# Altium project ALTIUM_{TEX139}_HV-1PH-DCAC-R3.PrjPcb (part 2 of 2)

## Sheet JTAG-USB-POWER.SchDoc
size A4; PageSetup: Record=PageOptions|CenterHorizontal=True|CenterVertical=True|PrintScale=1.06|XCorrection=1.00|YCorrection=1.00|PrintKind=1|BorderSize=5000000|LeftOffset=0|BottomOffset=0|Orientation=2|PaperLength=1000|PaperWidth=1000|Scale=100|PaperSource=15|PrintQuality=600|MediaType=1|DitherType=10|PaperKind=Legal|PrintScaleMode=1
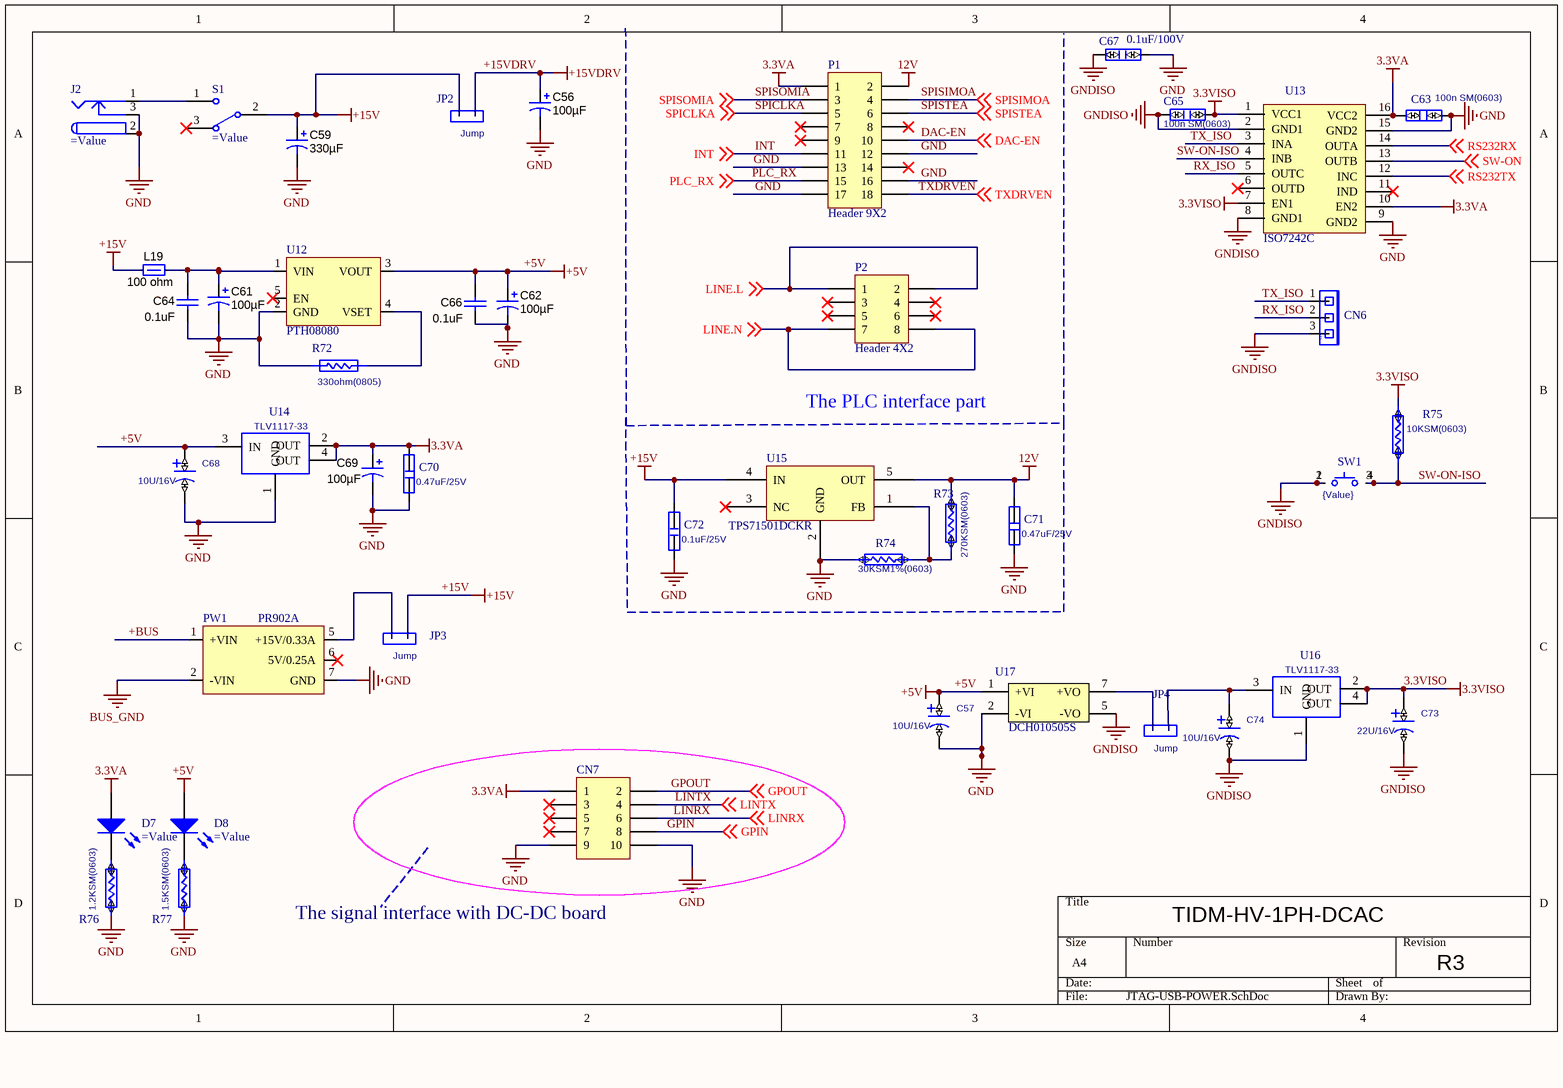
[diagram p2: JTAG-USB-POWER.SchDoc]

### Parts
C56  ValueDisplayed: 100µF  [CAPSMT_62_HA0]  (hidden comment: EMVA500ADA101MHA0G)
C57  10U/16V  [CAP-3528]
C59  ValueDisplayed: 330µF  [CAPSMT_62_HA0]  (hidden comment: 2R5SVPE330M)
C61  ValueDisplayed: 100µF  [CAPSMT_62_HA0]  (hidden comment: EMVA500ADA101MHA0G)
C62  ValueDisplayed: 100µF  [CAPSMT_62_HA0]  (hidden comment: EMVA500ADA101MHA0G)
C63  100n SM(0603)  [C0603SM]
C64  value 0.1uF  [0805]  (hidden comment: Used in BOM report)
C65  100n SM(0603)  [C0603SM]
C66  value 0.1uF  [0805]  (hidden comment: Used in BOM report)
C67  0.1uF/100V  [C/7.5/3/7.5/R3]
C68  10U/16V  [CAP-3528]
C69  ValueDisplayed: 100µF  [CAPSMT_62_HA0]  (hidden comment: EMVA500ADA101MHA0G)
C70  0.47uF/25V  [C0603SM]
C71  0.47uF/25V  [C0603SM]
C72  0.1uF/25V  [C0603SM]
C73  22U/16V  [CAP-3528]
C74  10U/16V  [CAP-3528]
CN6  SCI_PORT  [HDR1X3]  (value not drawn)
CN7  (no value)  [HDR2X5]
D7  (no value)  [LED0805]
D8  (no value)  [LED0805]
J2  (no value)  [DCJACK]
JP2  Jump  [HDR1X2]
JP3  Jump  [HDR1X2]
JP4  Jump  [HDR1X2]
L19  value 100 ohm  [1206]  (hidden comment: HI1206N101R-10)
P1  Header 9X2  [HDR2X9]
P2  Header 4X2  [HDR2X4]
PW1  (no value)  [PR902A]
R72  330ohm(0805)  [R0805BSM]
R73  270KSM(0603)  [R0603SM]
R74  30KSM1%(0603)  [R0603SM]
R75  10KSM(0603)  [R0603SM]
R76  1.2KSM(0603)  [R0603SM]
R77  1.5KSM(0603)  [R0603SM]
S1  (no value)  [SW-3P8X5]
SW1  {Value}  [KRS640]
U12  (no value)  [PTH08080]
U13  (no value)  [IC-SOIC16P-1.27DW]
U14  TLV1117-33  [SOT-223-3P]
U15  TPS71501DCKR  [SOT5-DCK(SC-70)]
U16  TLV1117-33  [SOT-223-3P]
U17  (no value)  [DCH010505]

### Nets
3.3VA: C63.2 C69.1(+) C70.2 CN7.1 D7.1(A) P1.1 U13.10(EN2) U13.16(VCC2) U14.2(OUT) U14.4(OUT)
3.3VISO: C65.1 C73.1 R75.1 U13.1(VCC1) U13.7(EN1) U16.2(OUT) U16.4(OUT)
12V: C71.2 P1.2 R73.1 U15.5(OUT)
+5V: C57.1 C62.1(+) C66.1 C68.1 D8.1(A) U12.3(VOUT) U14.3(IN) U17.1(+VI)
+15V: C59.1(+) C72.2 JP2.1 JP3.2 L19.1 S1.2 U15.4(IN)
+15VDRV: C56.1(+) JP2.2
BUS_GND: PW1.2(-VIN)  [project net Q2PWM-]
GND: C56.2(-) C57.2 C59.2(-) C61.2(-) C62.2(-) C63.1 C64.2 C66.2 C67.1 C68.2 C69.2(-) C70.1 C71.1 C72.1 CN7.9 CN7.10 J2.2 J2.3 P1.12 P1.13 P1.16 P1.17 PW1.7(GND) R72.1 R74.1 R76.2 R77.2 U12.2(GND) U13.9(GND2) U13.15(GND2) U14.1(GND) U15.2(GND) U17.2(-VI)
GNDISO: C65.2 C67.2 C73.2 C74.2 CN6.3 SW1.1 SW1.2 U13.2(GND1) U13.8(GND1) U16.1(GND) U17.5(-VO)
+BUS: PW1.1(+VIN)
DAC-EN: P1.10 ; off-sheet DAC-EN
GPIN: CN7.8 ; off-sheet GPIN
GPOUT: CN7.2 ; off-sheet GPOUT
INT: P1.11 ; off-sheet INT
LINE.L: P2.1 P2.2 ; off-sheet LINE.L
LINE.N: P2.7 P2.8 ; off-sheet LINE.N
LINRX: CN7.6 ; off-sheet LINRX
LINTX: CN7.4 ; off-sheet LINTX
PLC_RX: P1.15 ; off-sheet PLC_RX
RS232RX: U13.14(OUTA) ; off-sheet RS232RX
RS232TX: U13.12(INC) ; off-sheet RS232TX
RX_ISO: CN6.2 U13.5(OUTC)
SPICLKA: P1.5 ; off-sheet SPICLKA
SPISIMOA: P1.4 ; off-sheet SPISIMOA
SPISOMIA: P1.3 ; off-sheet SPISOMIA
SPISTEA: P1.6 ; off-sheet SPISTEA
SW-ON: U13.13(OUTB) ; off-sheet SW-ON
SW-ON-ISO: R75.2 SW1.3 SW1.4 U13.4(INB)
TX_ISO: CN6.1 U13.3(INA)
TXDRVEN: P1.18 ; off-sheet TXDRVEN
NetC61_1: C61.1(+) C64.1 L19.2 U12.1(VIN)
NetC74_1: C74.1 JP4.2 U16.3(IN)
NetD7_2: D7.2(K) R76.1
NetD8_2: D8.2(K) R77.1
NetJ2_1: J2.1 S1.1
NetJP3_1: JP3.1 PW1.5(+15V/0.33A)
NetJP4_1: JP4.1 U17.7(+VO)
NetR72_2: R72.2 U12.4(VSET)
NetR73_2: R73.2 R74.2 U15.1(FB)

Not connected (* = marked no-connect by the designer): CN7 3* 5* 7*; P1 7* 8* 9* 14*; P2 3* 4* 5* 6*; PW1 6(5V/0.25A)*; S1 3*; U12 5(EN)*; U13 6(OUTD)* 11(IND)*; U15 3(NC)*

### Notes on the sheet
- The PLC interface part
- The signal interface with DC-DC board
- TIDM-HV-1PH-DCAC
- R3
- (in symbol Component_1) PTH08080
- (in symbol DB01P03) F
- (in symbol ISO7242) ISO7242C

### Library data of the parts
C56 C61 C62 C69 = EMVA500ADA101MHA0G: CAP, AL, 100uF, 50V, +/-20%,  ohm, SMD; Manufacturer: Nippon Chemi-Con; Polarized: Y; CompType: Capacitor; U/M: EA; Cap_F: 0.0001; Tolerance_%: 20; Value1: Unknown; VDC_V: 50; IRMS_A: 0.19; TaMin_C: -40; TaMax_C: 85; Cap_Case: HA0; SymbolVersion: 2008-07-09; Value: 100uF; PartNumber: EMVA500ADA101MHA0G; PackageReference: HA0; RoHS: Y; Value2: 50V; MountType: SMT; Technology: AL; Series: MVA; Publisher: Texas Instruments; LatestRevisionDate: 2014-05-13; ComponentLink1Description: Datasheet link; ComponentLink1URL: http://www.chemi-con.co.jp/e/catalog/pdf/al-e/al-sepa-e/003-chip/al-mva-e-111201.pdf; Supplier 1: Digi-Key; Supplier Part Number 1: 565-2133-1-ND; Supplier 2: Mouser; Supplier Part Number 2: 661-EMVA500ADA101MHA; Supplier 3: Farnell; Supplier Part Number 3: 1698733
C57 C68 C73 C74 = CE5080R
  C57 C68 C74: Value: 10U/16V
  C73: Value: 22U/16V
C59 = 2R5SVPE330M: CAP, AL, 330uF, 2.5V, +/-20%, 0.015 ohm, SMD; Manufacturer: Sanyo; Polarized: Y; CompType: Capacitor; U/M: EA; Cap_F: 0.00033; Tolerance_%: 20; VDC_V: 2.5; ESR_Ohm: 0.015; IRMS_A: 3.15; TaMin_C: -55; TaMax_C: 105; SymbolVersion: 2008-07-09; Value: 330uF; PartNumber: 2R5SVPE330M; PackageReference: E61; RoHS: Y; Value1: 0.015 ohm; Value2: 2.5V; MountType: SMT; Technology: AL; Series: SVPE; Publisher: Texas Instruments; LatestRevisionDate: 2014-06-17; ComponentLink1Description: Datasheet link; ComponentLink1URL: http://industrial.panasonic.com/www-data/pdf/AAB8000/AAB8000CE2.pdf
C63 C65 = C0603SM: Value: 100n SM(0603)
C64 C66 = Capacitor: CAP, CERM, xxxF, xxV, [TempCo], xx%, [PackageReference]; Polarized: N; U/M: EA; CompType: Capacitor; SymbolVersion: 2008-07-09; PackageReference: Used in PnP output; Manufacturer: Used in BOM report; PartNumber: Used in BOM report; RoHS: Used in BOM report.  Use Y or N.; MountType: SMT or TH (used in PnP report); ComponentLink1Description: Datasheet Link; ComponentLink1URL: Paste URL for datasheet here; Publisher: Texas Instruments; LatestRevisionDate: 2014-06-06; LatestRevisionNote: Added Alternate PartNumber and Alternate Manufacturer parameters to appropriate components.; Alternate Manufacturer: -; Alternate PartNumber: -
C67 = C0603SM: Value: 100n
C70-C72 = C0805BSM
  C70 C71: Value: 0.47uF/25V
  C72: Value: 0.1uF/25V
CN6 = DB01P03: Value: SCI_PORT
CN7 = Header 5X2: Header, 5-Pin, Dual row; LatestRevisionDate: 17-Jul-2002; LatestRevisionNote: Re-released for DXP Platform.; Publisher: Altium Limited
D7 D8 = LED0: Typical INFRARED GaAs LED; Published: 8-Jun-2000; LatestRevisionDate: 08-Jul-2005; LatestRevisionNote: Mech Layer 1 removed.; PackageReference: LED-0; Publisher: Altium Limited
J2 = PWR2.5: Low Voltage Power Supply Connector; Published: 17-Dec-2003; DatasheetDocument: 09-May-2002; Publisher: Altium Limited; ComponentLink1Description: Manufacturer Link; ComponentLink1URL: http://domino.kycon.com/internet/Products.html
JP2-JP4 = J7: Value: Jump
L19 = HI1206N101R-10: Ferrite Bead, 100 ohm @ 100MHz, 3A, 1206; Manufacturer: Laird-Signal Integrity Products; Imax_A: 3; DCR_ohm: 0.035; Value1: 0.035 ohm; ZTyp@100MHz_Ohm: 100; Ztyp@1GHz_Ohm: 145; CompType: Ferrite Bead; SymbolVersion: 2009-06-02; PartNumber: HI1206N101R-10; Value2: 3A; MountType: SMT; PackageReference: 1206; Published: 2014-04-30; Publisher: Texas Instruments; LatestRevisionDate: 2014-04-30; ComponentLink1Description: Datasheet link; ComponentLink1URL: http://www.lairdtech.com/DownloadAsset.aspx?id=4847; RoHS: Y; Supplier 1: Digi-Key; Supplier Part Number 1: 240-2408-1-ND; Supplier 2: Mouser; Supplier Part Number 2: 875-HI1206N101R-10; Supplier 3: Farnell; Supplier Part Number 3: 1697228
P1 = Header 9X2: Header, 9-Pin, Dual row; LatestRevisionDate: 17-Jul-2002; LatestRevisionNote: Re-released for DXP Platform.; Publisher: Altium Limited
P2 = Header 4X2: Header, 4-Pin, Dual row; LatestRevisionDate: 17-Jul-2002; LatestRevisionNote: Re-released for DXP Platform.; Publisher: Altium Limited
PW1 = PR902A
R72 = R0805BSM: Value: 330ohm(0805)
R73-R77 = R0603SM
  R73: Value: 270KSM(0603)
  R74: Value: 30KSM1%(0603)
  R75: Value: 10KSM(0603)
  R76: Value: 1.2KSM(0603)
  R77: Value: 1.5KSM(0603)
S1 = SW-SPDT: SPDT Subminiature Toggle Switch, Right Angle Mounting, Vertical Actuation; Published: 24-Mar-1999; LatestRevisionDate: 17-Dec-2003; LatestRevisionNote: Schematic revised, PCB Footprint replaced.; DatasheetDocument: 05-Dec-2000; PackageReference: TL36WW15050; Publisher: Altium Limited; ComponentLink1Description: Manufacturer Link; ComponentLink1URL: http://www.apem.com
SW1 = KRS640: PDIF_TY: 12600; Value: {Value}
U12 = Component_1
U13 = ISO7242
U14 U16 = LM1117SM: Value: TLV1117-33
U17 = DCH010505S

## Nets that join several sheets
3.3VA: CNTL (L18.1 R69.2), Main (6 pins), JTAG-USB-POWER (10 pins)
+5V: CNTL (6 pins), Main (7 pins), JTAG-USB-POWER (8 pins)
+15V: Main (8 pins), JTAG-USB-POWER (7 pins)
+15VDRV: Main (CN1.1 CN2.1 CN3.1 CN4.1), JTAG-USB-POWER (C56.1 JP2.2)
GND: CNTL (30 pins), Main (36 pins), JTAG-USB-POWER (33 pins)
Q2PWM-: CNTL (R78.1), Main (29 pins), JTAG-USB-POWER (PW1.2)
+BUS: Main (14 pins), JTAG-USB-POWER (PW1.1)
BUS.V+: CNTL (R79.2), Main (C9.1 R15.1 R16.2)
DAC-EN: CNTL (H5.70), JTAG-USB-POWER (P1.10)
FAULT: CNTL (R70.1), Main (CN1.7 CN2.7 CN3.7 CN4.7)
GPIN: CNTL (H5.57), JTAG-USB-POWER (CN7.8)
GPOUT: CNTL (H5.61), JTAG-USB-POWER (CN7.2)
I.inv1+: CNTL (R67.1), Main (U1.9)
INT: CNTL (H5.68), JTAG-USB-POWER (P1.11)
LINE.L: Main (F1.3 F1.4 J1.1 TP1.1), JTAG-USB-POWER (P2.1 P2.2)
LINE.N: Main (F3.3 F3.4 J1.2 TP2.1), JTAG-USB-POWER (P2.7 P2.8)
LINE.V+: CNTL (R60.1), Main (R2.2)
LINRX: CNTL (H5.63), JTAG-USB-POWER (CN7.6)
LINTX: CNTL (H5.59), JTAG-USB-POWER (CN7.4)
N.V+: CNTL (R56.1), Main (R27.2)
OPRLY: CNTL (H5.52), Main (R30.1)
PLC_RX: CNTL (H5.12 H5.27), JTAG-USB-POWER (P1.15)
Q1.PWM: CNTL (TP15.1 U9.16), Main (CN1.4)
Q2.PWM: CNTL (TP16.1 U9.15), Main (CN2.4)
Q3.PWM: CNTL (TP17.1 U9.14), Main (CN3.4)
Q4.PWM: CNTL (TP20.1 U9.13), Main (CN4.4)
RESET: CNTL (R71.1), Main (CN1.6 CN2.6 CN3.6 CN4.6)
RS232RX: CNTL (H5.60), JTAG-USB-POWER (U13.14)
RS232TX: CNTL (H5.58), JTAG-USB-POWER (U13.12)
SD_CLK_Grid: CNTL (H5.50 H5.101 H5.105 H5.109), Main (U2.13 U3.13 U5.13)
SD_CLK_Vbus: CNTL (H5.54 H5.102), Main (U6.13)
SD_DATA_CapI: CNTL (H5.99), Main (U2.11)
SD_DATA_GridI: CNTL (H5.103), Main (U5.11)
SD_DATA_GridV: CNTL (H5.107), Main (U3.11)
SD_DATA_Vbus: CNTL (H5.100), Main (U6.11)
SPICLKA: CNTL (H5.71), JTAG-USB-POWER (P1.5)
SPISIMOA: CNTL (H5.67), JTAG-USB-POWER (P1.4)
SPISOMIA: CNTL (H5.69), JTAG-USB-POWER (P1.3)
SPISTEA: CNTL (H5.73), JTAG-USB-POWER (P1.6)
SW-ON: CNTL (H5.56), JTAG-USB-POWER (U13.13)
TXDRVEN: CNTL (H5.72), JTAG-USB-POWER (P1.18)